# Altium schematic sheet Board_B_SCH.SchDoc
size A3; SheetNumber: 1; SheetTotal: 1
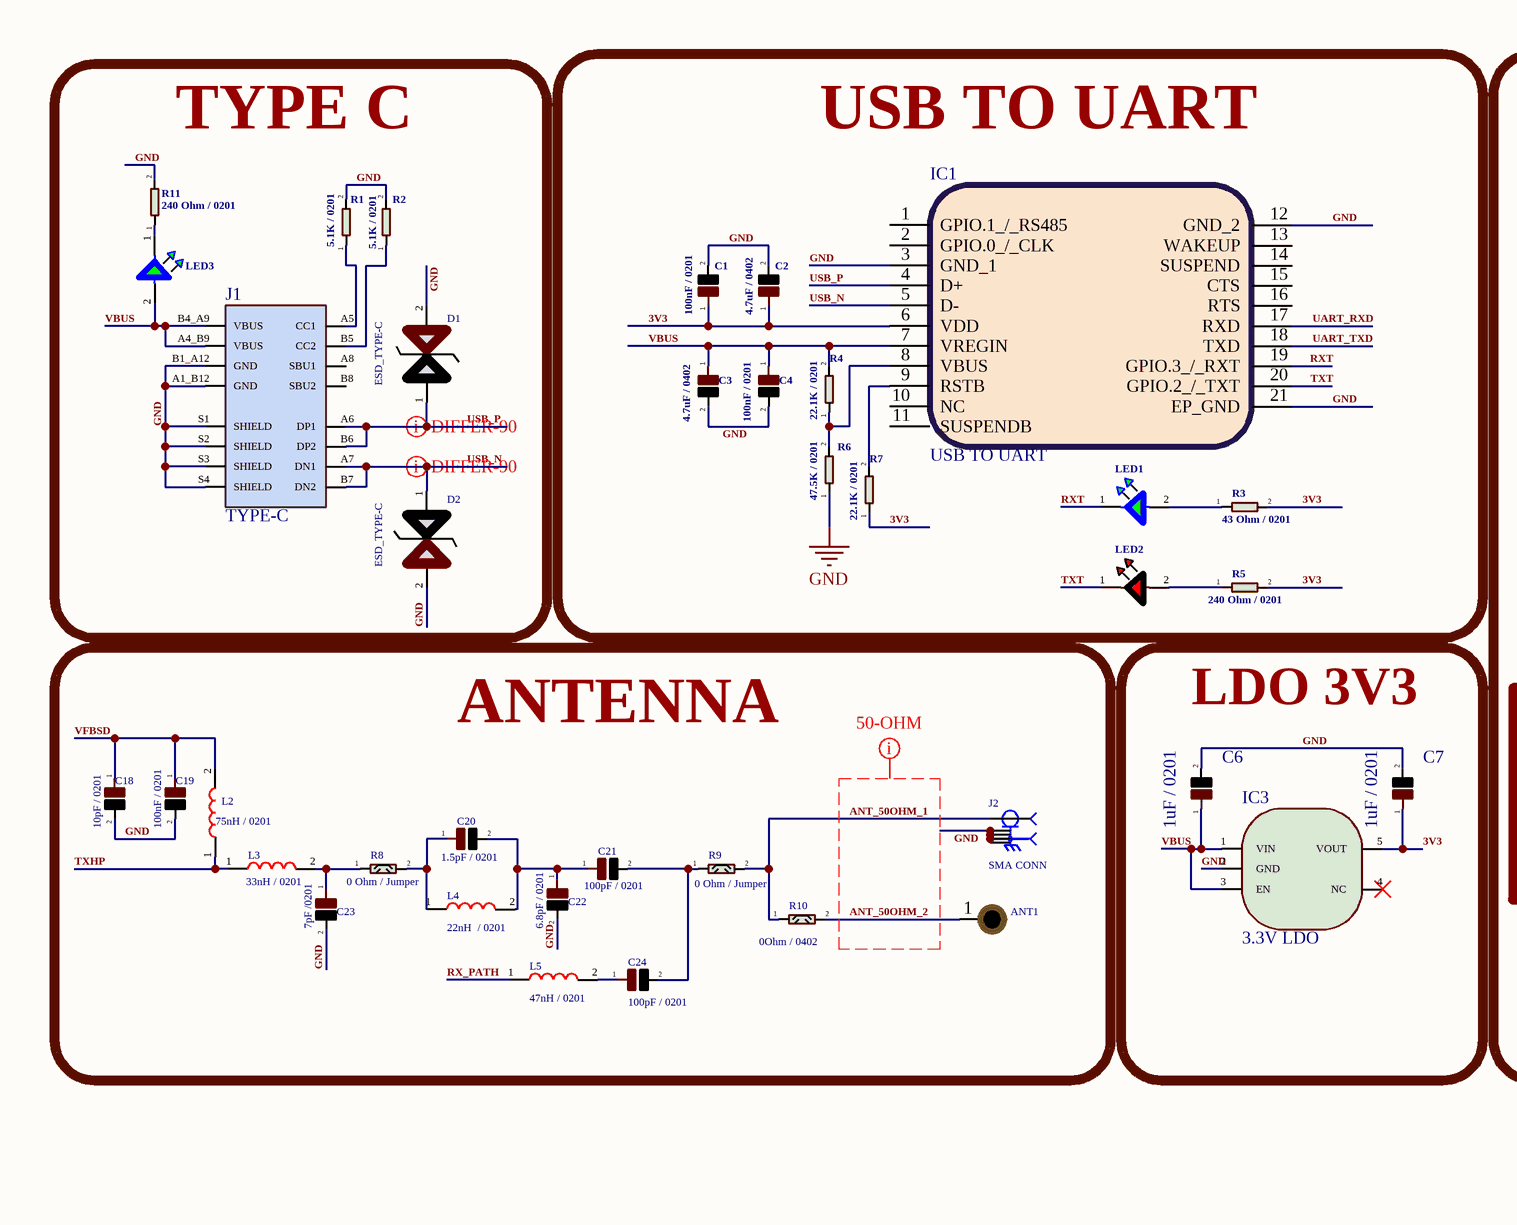
[diagram p0: Board_B_SCH.SchDoc, left]
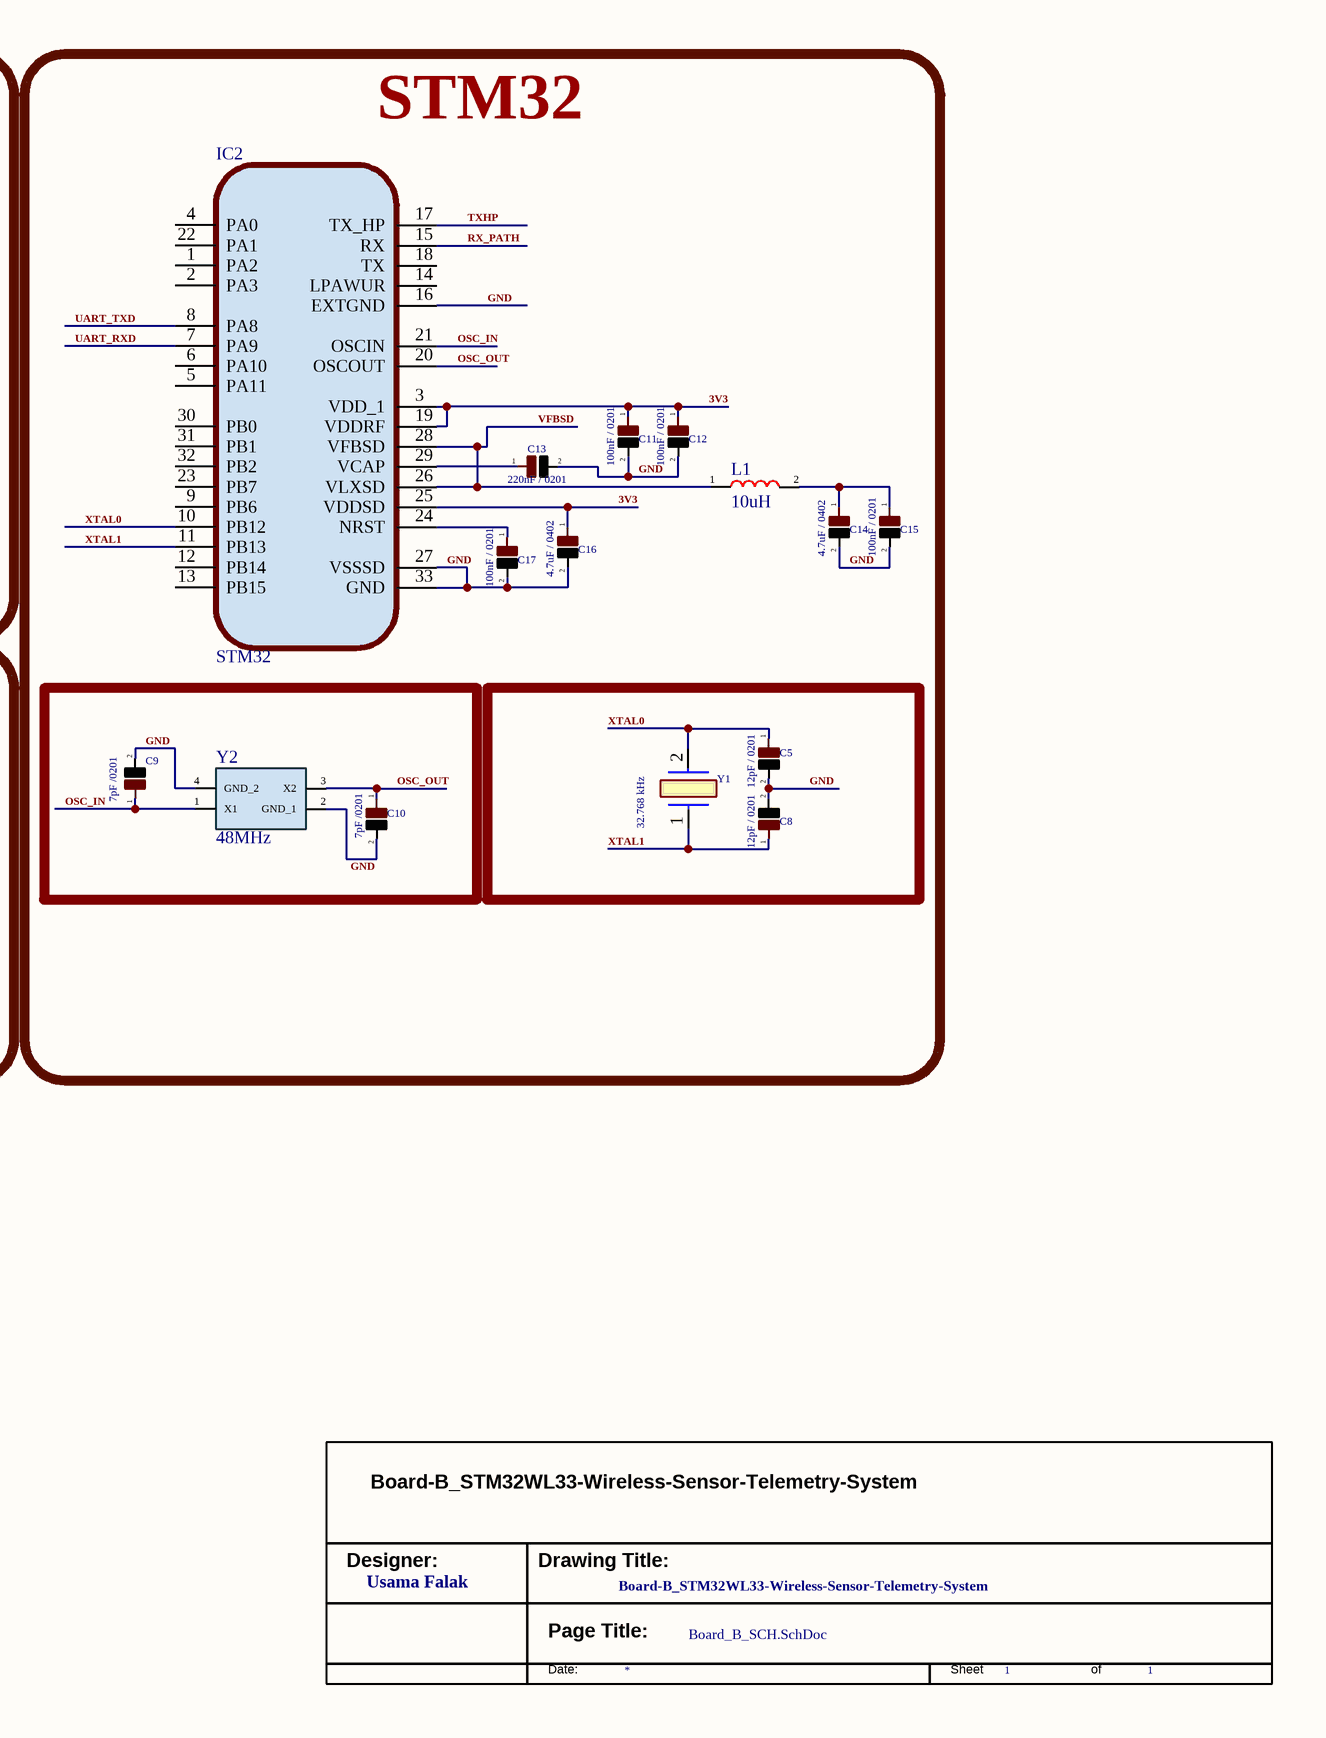
[diagram p1: Board_B_SCH.SchDoc, right]

## Parts
*  TitleBlock_MCPG_B  (value not drawn)  (graphical)
ANT1  PAD  [ANTENNA-PAD]  (value not drawn)
C1  100nF / 0201  [CAPC-C0201]
C2  4.7uF / 0402  [CAPC-C0402]
C3  4.7uF / 0402  [CAPC-C0402]
C4  100nF / 0201  [CAPC-C0201]
C5  12pF / 0201  [CAPC-C0201]
C6  1uF / 0201  [CAPC-C0201]
C7  1uF / 0201  [CAPC-C0201]
C8  12pF / 0201  [CAPC-C0201]
C9  7pF /0201  [CAPC-C0201]
C10  7pF /0201  [CAPC-C0201]
C11  100nF / 0201  [CAPC-C0201]
C12  100nF / 0201  [CAPC-C0201]
C13  220nF / 0201  [CAPC-C0201]
C14  4.7uF / 0402  [CAPC-C0402]
C15  100nF / 0201  [CAPC-C0201]
C16  4.7uF / 0402  [CAPC-C0402]
C17  100nF / 0201  [CAPC-C0201]
C18  10pF / 0201  [CAPC-C0201]
C19  100nF / 0201  [CAPC-C0201]
C20  1.5pF / 0201  [CAPC-C0201]
C21  100pF / 0201  [CAPC-C0201]
C22  6.8pF / 0201  [CAPC-C0201]
C23  7pF /0201  [CAPC-C0201]
C24  100pF / 0201  [CAPC-C0201]
D1  ESD_TYPE-C  [PESD5V0V1BB115]
D2  ESD_TYPE-C  [PESD5V0V1BB115]
IC1  USB TO UART  [CP2102NA02GQFN20]
IC2  STM32  [QFN50P500X500X100-33N-D]
IC3  3.3V LDO  [SOT95P285X140-5N]
J1  TYPE-C  [HRO_TYPE-C-31-M-12]
J2  SMA CONN  [SAMTEC_SMA-J-P-H-ST-EM1]
L1  10uH  [IND-C1608X95N]
L2  75nH / 0201  [INDC-C0201]
L3  33nH / 0201  [INDC-C0201]
L4  22nH  / 0201  [INDC-C0201]
L5  47nH / 0201  [IND-0201]
LED1  GREEN-LED  [LEDC-C0201]  (value not drawn)
LED2  RED-LED  [LEDC-C0201]  (value not drawn)
LED3  GREEN-LED  [LEDC-C0201]  (value not drawn)
R1  5.1K / 0201  [RESC-C0201]
R2  5.1K / 0201  [RESC-C0201]
R3  43 Ohm / 0201  [RESC-C0201]
R4  22.1K / 0201  [RESC-C0201]
R5  240 Ohm / 0201  [RESC-C0201]
R6  47.5K / 0201  [RESC-C0201]
R7  22.1K / 0201  [RESC-C0201]
R8  0 Ohm / Jumper  [RESC-C0201]
R9  0 Ohm / Jumper  [RESC-C0201]
R10  0Ohm / 0402  [RESC-C0402]
R11  240 Ohm / 0201  [RESC-C0201]
Y1  32.768 kHz  [Q13FC1350000400]
Y2  48MHz  [ABM11W300000MHZ4B1UT3]

## Blocks framed on the sheet
TYPE C: D1 D2 J1 LED3 R1 R2 R11
USB TO UART: C1-C4 IC1 LED1 LED2 R3-R7
STM32: C5 C8-C17 IC2 L1 Y1 Y2
ANTENNA: ANT1 C18-C24 J2 L2-L5 R8-R10
LDO 3V3: C6 C7 IC3

## Nets
GND: C1.2 C2.2 C3.2 C4.2 C5.2 C6.2 C7.2 C8.2 C9.2 C10.2 C11.2 C12.2 C13.2 C14.2 C15.2 C16.2 C17.2 C18.2 C19.2 C22.2 C23.2 D1.2(K2) D2.2(K2) IC1.3(GND_1) IC1.12(GND_2) IC1.21(EP_GND) IC2.16(EXTGND) IC2.27(VSSSD) IC2.33(GND) IC3.2(GND) J1.A1_B12(GND) J1.B1_A12(GND) J1.S1(SHIELD) J1.S2(SHIELD) J1.S3(SHIELD) J1.S4(SHIELD) J2.2_1 J2.2_2 J2.3_1 J2.3_2 R1.2 R2.2 R6.1 R11.2 Y2.2(GND_1) Y2.4(GND_2)
3V3: C1.1 C2.1 C7.1 C11.1 C12.1 C16.1 IC1.6(VDD) IC2.3(VDD_1) IC2.19(VDDRF) IC2.25(VDDSD) IC3.5(VOUT) R3.2 R5.2 R7.1
ANT_50OHM_1: J2.1 R9.2 R10.1
ANT_50OHM_2: ANT1.1 R10.2
OSC_IN: C9.1 IC2.21(OSCIN) Y2.1(X1)
OSC_OUT: C10.1 IC2.20(OSCOUT) Y2.3(X2)
RX_PATH: IC2.15(RX) L5.1
RXT: IC1.19(GPIO.3_/_RXT) LED1.1(K)
TXHP: IC2.17(TX_HP) L2.1 L3.1
TXT: IC1.20(GPIO.2_/_TXT) LED2.1(K)
UART_RXD: IC1.17(RXD) IC2.7(PA9)
UART_TXD: IC1.18(TXD) IC2.8(PA8)
USB_N: D2.1(K1) IC1.5(D-) J1.A7(DN1) J1.B7(DN2)
USB_P: D1.1(K1) IC1.4(D+) J1.A6(DP1) J1.B6(DP2)
VBUS: C3.1 C4.1 C6.1 IC1.7(VREGIN) IC3.1(VIN) IC3.3(EN) J1.A4_B9(VBUS) J1.B4_A9(VBUS) LED3.2(A) R4.2
VFBSD: C18.1 C19.1 IC2.26(VLXSD) IC2.28(VFBSD) L1.1 L2.2
XTAL0: C5.1 IC2.10(PB12) Y1.2(CRYSTAL_2)
XTAL1: C8.1 IC2.11(PB13) Y1.1
NetC13_1: C13.1 IC2.29(VCAP)
NetC14_1: C14.1 C15.1 L1.2
NetC17_1: C17.1 IC2.24(NRST)
NetC20_1: C20.1 L4.1 R8.2
NetC20_2: C20.2 C21.1 C22.1 L4.2
NetC21_2: C21.2 C24.2 R9.1
NetC23_1: C23.1 L3.2 R8.1
NetC24_1: C24.1 L5.2
NetIC1_8: IC1.8(VBUS) R4.1 R6.2
NetIC1_9: IC1.9(RSTB) R7.2
NetJ1_A5: J1.A5(CC1) R1.1
NetJ1_B5: J1.B5(CC2) R2.1
NetLED1_2: LED1.2(A) R3.1
NetLED2_2: LED2.2(A) R5.1
NetLED3_1: LED3.1(K) R11.1

Not connected (* = marked no-connect by the designer): IC1 1(GPIO.1_/_RS485) 2(GPIO.0_/_CLK) 10(NC) 11(SUSPENDB) 13(WAKEUP) 14(SUSPEND) 15(CTS) 16(RTS); IC2 1(PA2) 2(PA3) 4(PA0) 5(PA11) 6(PA10) 9(PB6) 12(PB14) 13(PB15) 14(LPAWUR) 18(TX) 22(PA1) 23(PB7) 30(PB0) 31(PB1) 32(PB2); IC3 4(NC)*; J1 A8(SBU1) B8(SBU2)

## Layout directives
differential pair; differential pair class 90-OHM: USB_N, USB_P
net class 50OHM: ANT_50OHM_1, ANT_50OHM_2

## Notes on the sheet
- (in symbol TitleBlock_MCPG_B) Board-B_STM32WL33-Wireless-Sensor-Telemetry-System; Designer:; Drawing Title:; Usama Falak; Page Title:; Date:; Sheet; of

## Library data of the parts
ANT1 = ANTENNA-PAD
C1 C4 C11 C12 C15 C17 C19 = GRM033Z71C104KE14J: Multilayer Ceramic Capacitors MLCC - SMD/SMT 0.1 uF 16 VDC 10% 0201 X7R; Manufacturer_Name: Murata Electronics; Datasheet Link: https://search.murata.co.jp/Ceramy/image/img/A01X/G101/ENG/GRM033Z71C104KE14-01A.pdf; Height: 0.33mm; Manufacturer_Part_Number: GRM033Z71C104KE14J; Mouser Part Number: 81-GRM033Z71C104KE4J; Mouser Price/Stock: https://www.mouser.co.uk/ProductDetail/Murata-Electronics/GRM033Z71C104KE14J?qs=lEfY3O89AqkOnRdov738ag%3D%3D; LCSC-Part#: C5755505
C2 C3 C14 C16 = GRM155C61E475ME15J: 4.7uF ±20% 25V Ceramic Capacitor 0402; Manufacturer_Name: Murata Electronics; Datasheet Link: https://search.murata.co.jp/Ceramy/image/img/A01X/G101/ENG/GRM155C61E475ME15-01A.pdf; Height: 0.33mm; Manufacturer_Part_Number: GRM155C61E475ME15J; Mouser Part Number: 81-GRM15C61E475ME15J; Mouser Price/Stock: https://www.mouser.co.uk/ProductDetail/Murata-Electronics/GRM155C61E475ME15J?qs=By6Nw2ByBD02p8xq06vhEQ%3D%3D; Arrow Part Number: GRM155C61E475ME15J; Arrow Price/Stock: https://www.arrow.com/en/products/grm155c61e475me15j/murata-manufacturing?utm_currency=USD&region=nac; LCSC-Part#: C5846150
C5 C8 = GJM0335C1E120GB01D: 12pF ±2% 25V Ceramic Capacitor X6S 0201; Manufacturer_Name: Murata Electronics; Datasheet Link: https://search.murata.co.jp/Ceramy/image/img/A01X/G101/ENG/GJM0335C1E120GB01-31A.pdf; Height: 0.33mm; Manufacturer_Part_Number: GJM0335C1E120GB01D; Mouser Part Number: 81-GJM0335C1E120GB1D; Mouser Price/Stock: https://www.mouser.co.uk/ProductDetail/Murata-Electronics/GJM0335C1E120GB01D?qs=ui%252B2d9lVEI54IbZGcLUeEQ%3D%3D; Arrow Part Number: GJM0335C1E120GB01D; Arrow Price/Stock: https://www.arrow.com/en/products/gjm0335c1e120gb01d/murata-manufacturing?region=nac; LCSC-Part#: C710720
C6 C7 = GRM033R61C105ME15D: Multilayer Ceramic Capacitors MLCC - SMD/SMT 1 uF 16 VDC 20% 0201 X5R; Manufacturer_Name: Murata Electronics; Datasheet Link: https://search.murata.co.jp/Ceramy/image/img/A01X/G101/ENG/GRM033R61C105ME15-01A.pdf; Height: 0.33mm; Manufacturer_Part_Number: GRM033R61C105ME15D; Mouser Part Number: 81-GRM033R61C105ME5D; Mouser Price/Stock: https://www.mouser.co.uk/ProductDetail/Murata-Electronics/GRM033R61C105ME15D?qs=u16ybLDytRZR0II5ummfwQ%3D%3D; Arrow Part Number: GRM033R61C105ME15D; Arrow Price/Stock: https://www.arrow.com/en/products/grm033r61c105me15d/murata-manufacturing?utm_currency=USD&region=europe; LCSC-Part#: C335102
C9 C10 C23 = GJM0335C1E7R0BB01D: 7pF 25V Ceramic Capacitor C0G 0201; Manufacturer_Name: Murata Electronics; Datasheet Link: https://search.murata.co.jp/Ceramy/image/img/A01X/G101/ENG/GJM0335C1E7R0BB01-31A.pdf; Height: 0.33mm; Manufacturer_Part_Number: GJM0335C1E7R0BB01D; LCSC-Part#: C1864565
C13 = GRM033C81A224KE01D: 220nF X6S ±10% 10V 0201 Ceramic Capacitors RoHS; Manufacturer_Name: Murata Electronics; Datasheet Link: https://search.murata.co.jp/Ceramy/image/img/A01X/G101/ENG/GRM033C81A224KE01-01A.pdf; Height: 0.33mm; Manufacturer_Part_Number: GRM033C81A224KE01D; LCSC-Part#: C20044506
C18 = GJM0335C1E100GB01D: 10pF ±2% 25V Ceramic Capacitor C0G 0201; Manufacturer_Name: Murata Electronics; Datasheet Link: https://search.murata.co.jp/Ceramy/image/img/A01X/G101/ENG/GJM0335C1E100GB01-31A.pdf; Height: 0.33mm; Manufacturer_Part_Number: GJM0335C1E100GB01D; Mouser Part Number: 81-GJM0335C1E100GB1D; Mouser Price/Stock: https://www.mouser.co.uk/ProductDetail/Murata-Electronics/GJM0335C1E100GB01D?qs=ui%252B2d9lVEI7JJM6SC54Bmg%3D%3D; LCSC-Part#: C237422
C20 = GJM0335C1E1R5WB01D: 1.5pF 25V Ceramic Capacitor C0G 0201; Manufacturer_Name: Murata Electronics; Datasheet Link: https://search.murata.co.jp/Ceramy/image/img/A01X/G101/ENG/GJM0335C1E1R5WB01-01A.pdf; Height: 0.33mm; Manufacturer_Part_Number: GJM0335C1E1R5WB01D; Mouser Part Number: 81-GJM0335C1E1R5WB1D; Mouser Price/Stock: https://www.mouser.co.uk/ProductDetail/Murata-Electronics/GJM0335C1E1R5WB01D?qs=YLLXL5qGyDs1VzYPuYV7Xw%3D%3D; Arrow Part Number: GJM0335C1E1R5WB01D; Arrow Price/Stock: https://www.arrow.com/en/products/gjm0335c1e1r5wb01d/murata-manufacturing?utm_currency=USD&region=nac; LCSC-Part#: C435397
C21 C24 = GRM0335C1E101FA01D: Multilayer Ceramic Capacitors MLCC - SMD/SMT 100 pF 25 VDC 1% 0201 C0G (NP0); Manufacturer_Name: Murata Electronics; Datasheet Link: https://search.murata.co.jp/Ceramy/image/img/A01X/G101/ENG/GRM0335C1E101FA01-01A.pdf; Height: 0.33mm; Manufacturer_Part_Number: GRM0335C1E101FA01D; Mouser Part Number: 81-GRM0335C1E101FA1D; Mouser Price/Stock: https://www.mouser.co.uk/ProductDetail/Murata-Electronics/GRM0335C1E101FA01D?qs=3ZwS9AhGA%2F51pgyoCpOmmA%3D%3D; Arrow Part Number: GRM0335C1E101FA01D; Arrow Price/Stock: https://www.arrow.com/en/products/grm0335c1e101fa01d/murata-manufacturing; LCSC-Part#: C527989
C22 = GJM0335C1E6R8CB01D: Multilayer Ceramic Capacitors MLCC - SMD/SMT 6.8 pF 25 VDC 0.25 pF 0201 C0G (NP0); Manufacturer_Name: Murata Electronics; Datasheet Link: https://search.murata.co.jp/Ceramy/image/img/A01X/G101/ENG/GJM0335C1E6R8CB01-01A.pdf; Height: 0.33mm; Manufacturer_Part_Number: GJM0335C1E6R8CB01D; LCSC-Part#: C415404
D1 D2 = PESD5V0V1BB,115: ESD Protection Diodes / TVS Diodes The factory is currently not accepting orders for this product.; Manufacturer_Name: Nexperia; Datasheet Link: https://assets.nexperia.com/documents/data-sheet/PESD5V0V1BB.pdf; Height: 0.65mm; Manufacturer_Part_Number: PESD5V0V1BB,115; Mouser Part Number: 771-PESD5V0V1BB115; Mouser Price/Stock: https://www.mouser.co.uk/ProductDetail/Nexperia/PESD5V0V1BB115?qs=GcY6OjH1zdkfLKV5vNnV%252BA%3D%3D; Arrow Part Number: PESD5V0V1BB,115; Arrow Price/Stock: https://www.arrow.com/en/products/pesd5v0v1bb115/nexperia?region=nac; LCSC-Part#: C477993
IC1 = CP2102N-A02-GQFN20R: USB Bridge, USB to UART USB 2.0 UART Interface 20-QFN (3x3); Manufacturer_Name: Silicon Labs; Datasheet Link: https://www.silabs.com/documents/public/data-sheets/cp2102n-datasheet.pdf; Height: 0.8mm; Manufacturer_Part_Number: CP2102N-A02-GQFN20R; Mouser Part Number: 634-CP2102NA02QFN20R; Mouser Price/Stock: https://www.mouser.co.uk/ProductDetail/Silicon-Labs/CP2102N-A02-GQFN20R?qs=u16ybLDytRbf2uwPkMBdUg%3D%3D; Arrow Part Number: CP2102N-A02-GQFN20R; Arrow Price/Stock: https://www.arrow.com/en/products/cp2102n-a02-gqfn20r/silicon-labs?utm_currency=USD&region=nac; LCSC-Part#: C969913
IC2 = STM32WL33KBV7: ARM Microcontrollers - MCU Sub-GHz Wireless MCU Single-core Arm Cortex-M0+ 64 MHz 128 Kb Flash 32 Kb SRAM; Manufacturer_Name: STMicroelectronics; Datasheet Link: https://www.st.com/resource/en/datasheet/stm32wl33c8.pdf; Height: 1mm; Manufacturer_Part_Number: STM32WL33KBV7; Arrow Part Number: STM32WL33KBV7; Arrow Price/Stock: https://www.arrow.com/en/products/stm32wl33kbv7/stmicroelectronics.html?utm_currency=USD&region=nac
IC3 = AP2112K-3.3TRG1: LDO Voltage Regulators 600mA CMOS LDO 50mA 3.3V 250mV; Manufacturer_Name: Diodes Incorporated; Datasheet Link: https://www.diodes.com//assets/Datasheets/AP2112.pdf; Height: 1.4mm; Manufacturer_Part_Number: AP2112K-3.3TRG1; Mouser Part Number: 621-AP2112K-3.3TRG1; Mouser Price/Stock: https://www.mouser.co.uk/ProductDetail/Diodes-Incorporated/AP2112K-3.3TRG1?qs=x6A8l6qLYDDPYHosCdzh%2FA%3D%3D; Arrow Part Number: AP2112K-3.3TRG1; Arrow Price/Stock: https://www.arrow.com/en/products/ap2112k-3.3trg1/diodes-incorporated.html?utm_currency=USD&region=asia
J1 = TYPE-C-31-M-12: USB Connectors 24 Receptacle 1 8.94*7.3mm RoHS; MF: HRO Electronics Co., Ltd.; SnapEDA_Link: https://www.snapeda.com/parts/TYPE-C-31-M-12/HRO+Electronics+Co.%252C+Ltd./view-part/?ref=snap; Package: Package; Value: *; MP: TYPE-C-31-M-12; Check_prices: https://www.snapeda.com/parts/TYPE-C-31-M-12/HRO+Electronics+Co.%252C+Ltd./view-part/?ref=eda; LCSC-Part#: C165948
J2 = SMA-J-P-H-ST-EM1: MF: Samtec; Package: None; Price: None; Value: *; MP: SMA-J-P-H-ST-EM1; Availability: Unavailable
L1 = MLZ1608M100WTD25: 10uH 1.05Ω Standard AEC-Q200; Manufacturer_Name: TDK; Datasheet Link: https://product.tdk.com/system/files/dam/doc/product/inductor/inductor/smd/catalog/inductor_automotive_decoupling_mlz1608_en.pdf; Height: 0.95mm; Manufacturer_Part_Number: MLZ1608M100WTD25; Mouser Part Number: 810-MLZ1608M100WTD25; Mouser Price/Stock: https://www.mouser.co.uk/ProductDetail/TDK/MLZ1608M100WTD25?qs=u4%252BEJ9urDATpNhOvJ54DAQ%3D%3D; Arrow Part Number: MLZ1608M100WTD25; Arrow Price/Stock: https://www.arrow.com/en/products/mlz1608m100wtd25/tdk?utm_currency=USD&region=europe; LCSC-Part#: C2047264
L2 = LQP03TN75NJ02D: 100mA 75nH ±5% 10Ω 0201 Fixed Inductors RoHS; Manufacturer_Name: Murata Electronics; Datasheet Link: https://search.murata.co.jp/Ceramy/image/img/P02/JELF243C-0015.pdf; Height: 0.33mm; Manufacturer_Part_Number: LQP03TN75NJ02D; Mouser Part Number: 81-LQP03TN75NJ02D; Mouser Price/Stock: https://www.mouser.com/Search/Refine.aspx?Keyword=81-LQP03TN75NJ02D; LCSC-Part#: C913516
L3 = LQP03TG33NJ02D: 110mA 33nH ±5% 4.25Ω 0201 Fixed Inductors RoHS; Manufacturer_Name: Murata Electronics; Datasheet Link: https://search.murata.co.jp/Ceramy/image/img/P02/JELF243C-0016.pdf; Height: 0.33mm; Manufacturer_Part_Number: LQP03TG33NJ02D; Mouser Part Number: 81-LQP03TG33NJ02D; Mouser Price/Stock: https://www.mouser.com/Search/Refine.aspx?Keyword=81-LQP03TG33NJ02D; LCSC-Part#: C337948
L4 = LQP03TG22NJ02D: 140mA 22nH ±5% 2.85Ω Thick Film Inductor 0201 Fixed Inductors RoHS; Manufacturer_Name: Murata Electronics; Datasheet Link: https://search.murata.co.jp/Ceramy/image/img/P02/JELF243C-0016.pdf; Height: 0.33mm; Manufacturer_Part_Number: LQP03TG22NJ02D; Mouser Part Number: 81-LQP03TG22NJ02D; Mouser Price/Stock: https://www.mouser.co.uk/ProductDetail/Murata-Electronics/LQP03TG22NJ02D?qs=%252BAZVS4b%2FkgKn6NoYx0zfhQ%3D%3D; LCSC-Part#: C237576
L5 = LQP03HQ47NH02D: Inductor; Manufacturer_Name: Murata Electronics; Datasheet Link: https://search.murata.co.jp/Ceramy/image/img/P02/JELF243C-0021.pdf; Height: 0.42mm; Manufacturer_Part_Number: LQP03HQ47NH02D; Mouser Part Number: 81-LQP03HQ47NH02D; Mouser Price/Stock: https://www.mouser.co.uk/ProductDetail/Murata-Electronics/LQP03HQ47NH02D?qs=B6kkDfuK7%2FDPvY4SgbF1QA%3D%3D
LED1 LED3 = XL-0201UGC: Emerald Green 525nm LED Indication - Discrete 3.3V 0201; Manufacturer_Name: XINGLIGHT; Datasheet Link: http://www.xinglight.cn/uploadfile/202403/c390b9cc98e0bd5.pdf; Height: 0.65mm; Manufacturer_Part_Number: XL-0201UGC
LED2 = XL-0201SURC: Red LED Indication - Discrete 0201; Manufacturer_Name: XINGLIGHT; Datasheet Link: http://www.xinglight.cn/uploadfile/202403/a9b8d0ab9895e7d.pdf; Height: 0.65mm; Manufacturer_Part_Number: XL-0201SURC; LCSC-Part#: C3646923; LCSC-Part: C3646923
R1 R2 = RC0201FR-075K1L: 5.1kΩ 50mW 25V Thick Film Resistor ±1% ±200ppm/℃ 0201 Chip Resistor - Surface Mount RoHS; Manufacturer_Name: Yageo Group; Datasheet Link: https://www.mouser.co.uk/datasheet/2/447/YAGEO_PYu_RC_Group_51_RoHS_L_12-3313492.pdf; Height: 0.26mm; Manufacturer_Part_Number: RC0201FR-075K1L; Mouser Part Number: 603-RC0201FR-075K1L; Mouser Price/Stock: https://www.mouser.co.uk/ProductDetail/YAGEO/RC0201FR-075K1L?qs=PyXrTqysiPSayNra3jUU7g%3D%3D; Arrow Part Number: RC0201FR-075K1L; Arrow Price/Stock: https://www.arrow.com/en/products/rc0201fr-075k1l/yageo.html?utm_currency=USD&region=nac; LCSC-Part#: C274341
R3 = AC0201FR-0743RL: 43Ω ±1% 50mW 0201 Thick Film; LCSC-Part#: C226550
R4 R7 = RC0201FR-0722K1L: 50mW 22.1kΩ 25V Thick Film Resistor ±1% ±200ppm/℃ 0201 Chip Resistor - Surface Mount RoHS; LCSC-Part#: C142019
R5 R11 = AC0201FR-07240RL: 50mW 240Ω 25V Thick Film Resistor ±1% ±200ppm/℃ 0201 Chip Resistor - Surface Mount RoHS; LCSC-Part#: C226476
R6 = CRCW020147K5FKED: 50mW 47.5kΩ 30V Thick Film Resistor ±1% ±100ppm/℃ 0201 Chip Resistor - Surface Mount RoHS; Manufacturer_Name: Vishay; Datasheet Link: http://www.vishay.com/docs/20035/dcrcwe3.pdf; Height: 0.28mm; Manufacturer_Part_Number: CRCW020147K5FKED; Mouser Part Number: 71-CRCW020147K5FKED; Mouser Price/Stock: http://www.mouser.com/Search/ProductDetail.aspx?qs=3bSaU8eFeoGgZld6FarxcA%3d%3d; Arrow Part Number: CRCW020147K5FKED; Arrow Price/Stock: https://www.arrow.com/en/products/crcw020147k5fked/vishay
R8 R9 = CRCW02010000Z0ED: Resistor; Manufacturer_Name: Vishay; Datasheet Link: http://www.vishay.com/docs/20035/dcrcwe3.pdf; Height: 0.28mm; Manufacturer_Part_Number: CRCW02010000Z0ED; Mouser Part Number: 71-CRCW02010000Z0ED; Mouser Price/Stock: https://www.mouser.co.uk/ProductDetail/Vishay-Dale/CRCW02010000Z0ED?qs=IQLUlsvFoXvEDlw%2FRr8tQg%3D%3D; Arrow Part Number: CRCW02010000Z0ED; Arrow Price/Stock: https://www.arrow.com/en/products/crcw02010000z0ed/vishay?utm_currency=USD&region=nac; LCSC-Part#: C844709
R10 = ERJ-2GE0R00X: 0 Ohms Jumper Chip Resistor 0402 (1005 Metric) Automotive AEC-Q200 Thick Film; Manufacturer_Name: Panasonic; Datasheet Link: http://industrial.panasonic.com/www-cgi/jvcr13pz.cgi?E+PZ+3+AOA0001+ERJ2GE0R00X+7+WW; Height: 0.4mm; Manufacturer_Part_Number: ERJ-2GE0R00X; Mouser Part Number: 667-ERJ-2GE0R00X; Mouser Price/Stock: https://www.mouser.co.uk/ProductDetail/Panasonic/ERJ-2GE0R00X?qs=Cz%252B5TvT4yly5%252BP7oLZcLxw%3D%3D; Arrow Part Number: ERJ-2GE0R00X; Arrow Price/Stock: https://www.arrow.com/en/products/erj2ge0r00x/panasonic?utm_currency=USD&region=nac; LCSC-Part#: C242160
Y1 = Q13FC1350000400: 32.768 kHz ±20ppm Crystal 12.5pF 70 kOhms 2-SMD, No Lead; Manufacturer_Name: Seiko Epson Corporation; Datasheet Link: https://datasheet.lcsc.com/szlcsc/1901081604_Seiko-Epson-Q13FC1350000400_C32346.pdf; Height: 0.9mm; Manufacturer_Part_Number: Q13FC1350000400; LCSC-Part#: C32346
Y2 = ABM11W-48.0000MHZ-7-B1U-T3: Crystal 48MHz ±10ppm 7pF 40Ω SMD2016-4P; Manufacturer_Name: ABRACON; Datasheet Link: https://abracon.com/Resonators/ABM11W.pdf; Height: 0.5mm; Manufacturer_Part_Number: ABM11W-48.0000MHZ-7-B1U-T3; Mouser Part Number: 815-11W48-7B1UT; Mouser Price/Stock: https://www.mouser.co.uk/ProductDetail/ABRACON/ABM11W-48.0000MHZ-7-B1U-T3?qs=5aG0NVq1C4zV3jiDtn%252BcSw%3D%3D; Arrow Part Number: ABM11W-48.0000MHZ-7-B1U-T3; Arrow Price/Stock: https://www.arrow.com/en/products/abm11w-48.0000mhz-7-b1u-t3/abracon?region=nac
* = TitleBlock_MCPG_B: Page Create Date: March  8, 1995